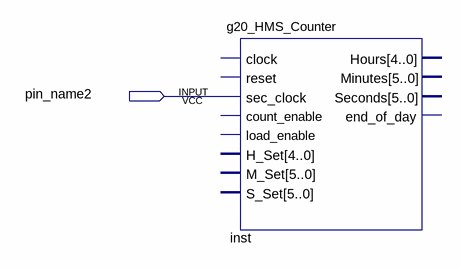
[diagram p0: schematic sheet]
// Quartus schematic g20_HMS_Counter.bdf as structural Verilog: 1 symbols, 1 pins
module g20_HMS_Counter (
  input  pin_name2
);

  g20_HMS_Counter inst (.sec_clock(pin_name2));  // open: clock, reset, count_enable, load_enable, H_Set, M_Set, S_Set, Hours, Minutes, Seconds, end_of_day
endmodule
